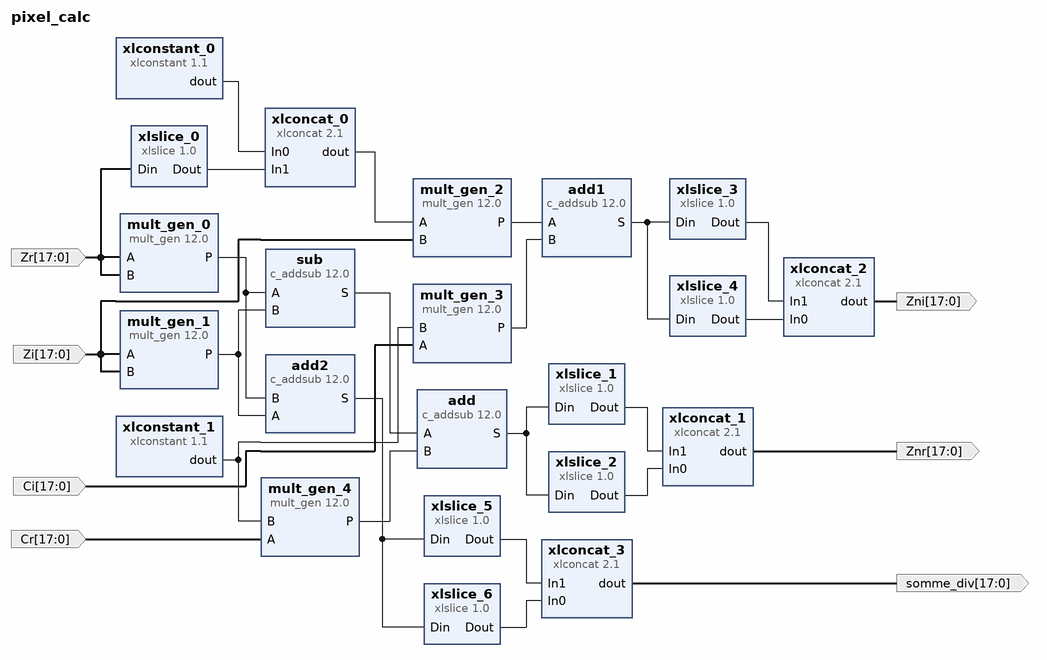
[diagram p0: block diagram of the top level]
# Vivado block design pixel_calc, xc7a200tsbg484-1, Vivado 2021.2
create_bd_design pixel_calc

create_bd_port -dir I -from 17 -to 0 -type data Ci
create_bd_port -dir I -from 17 -to 0 -type data Cr
create_bd_port -dir I -from 17 -to 0 -type data Zi
create_bd_port -dir O -from 17 -to 0 Zni
create_bd_port -dir O -from 17 -to 0 Znr
create_bd_port -dir I -from 17 -to 0 -type data Zr
create_bd_port -dir O -from 17 -to 0 somme_div

create_bd_cell -type ip -vlnv xilinx.com:ip:c_addsub:12.0 add
set_property -dict [list \
  CONFIG.A_Width 36 \
  CONFIG.Add_Mode Add \
  CONFIG.B_Value 000000000000000000000000000000000000 \
  CONFIG.B_Width 36 \
  CONFIG.CE false \
  CONFIG.Latency 0 \
  CONFIG.Out_Width 36 \
] [get_bd_cells add]
create_bd_cell -type ip -vlnv xilinx.com:ip:c_addsub:12.0 add1
set_property -dict [list \
  CONFIG.A_Width 36 \
  CONFIG.Add_Mode Add \
  CONFIG.B_Value 000000000000000000000000000000000000 \
  CONFIG.B_Width 36 \
  CONFIG.CE false \
  CONFIG.Latency 0 \
  CONFIG.Out_Width 36 \
] [get_bd_cells add1]
create_bd_cell -type ip -vlnv xilinx.com:ip:c_addsub:12.0 add2
set_property -dict [list \
  CONFIG.A_Width 36 \
  CONFIG.Add_Mode Add \
  CONFIG.B_Value 000000000000000000000000000000000000 \
  CONFIG.B_Width 36 \
  CONFIG.CE false \
  CONFIG.Latency 0 \
  CONFIG.Out_Width 36 \
] [get_bd_cells add2]
create_bd_cell -type ip -vlnv xilinx.com:ip:mult_gen:12.0 mult_gen_0
set_property -dict {CONFIG.Multiplier_Construction Use_Mults CONFIG.PipeStages 0} [get_bd_cells mult_gen_0]
create_bd_cell -type ip -vlnv xilinx.com:ip:mult_gen:12.0 mult_gen_1
set_property -dict {CONFIG.Multiplier_Construction Use_Mults CONFIG.PipeStages 0} [get_bd_cells mult_gen_1]
create_bd_cell -type ip -vlnv xilinx.com:ip:mult_gen:12.0 mult_gen_2
set_property -dict {CONFIG.Multiplier_Construction Use_Mults CONFIG.PipeStages 0} [get_bd_cells mult_gen_2]
create_bd_cell -type ip -vlnv xilinx.com:ip:mult_gen:12.0 mult_gen_3
set_property -dict {CONFIG.PipeStages 0} [get_bd_cells mult_gen_3]
create_bd_cell -type ip -vlnv xilinx.com:ip:mult_gen:12.0 mult_gen_4
set_property -dict {CONFIG.PipeStages 0} [get_bd_cells mult_gen_4]
create_bd_cell -type ip -vlnv xilinx.com:ip:c_addsub:12.0 sub
set_property -dict [list \
  CONFIG.A_Width 36 \
  CONFIG.Add_Mode Subtract \
  CONFIG.B_Value 000000000000000000000000000000000000 \
  CONFIG.B_Width 36 \
  CONFIG.CE false \
  CONFIG.Latency 0 \
  CONFIG.Out_Width 36 \
] [get_bd_cells sub]
create_bd_cell -type ip -vlnv xilinx.com:ip:xlconcat:2.1 xlconcat_0
set_property -dict {CONFIG.IN1_WIDTH 17} [get_bd_cells xlconcat_0]
create_bd_cell -type ip -vlnv xilinx.com:ip:xlconcat:2.1 xlconcat_1
set_property -dict {CONFIG.IN0_WIDTH 14 CONFIG.IN1_WIDTH 4} [get_bd_cells xlconcat_1]
create_bd_cell -type ip -vlnv xilinx.com:ip:xlconcat:2.1 xlconcat_2
set_property -dict {CONFIG.IN0_WIDTH 14 CONFIG.IN1_WIDTH 4} [get_bd_cells xlconcat_2]
create_bd_cell -type ip -vlnv xilinx.com:ip:xlconstant:1.1 xlconstant_0
set_property -dict {CONFIG.CONST_VAL 0 CONFIG.CONST_WIDTH 1} [get_bd_cells xlconstant_0]
create_bd_cell -type ip -vlnv xilinx.com:ip:xlconstant:1.1 xlconstant_1
set_property -dict {CONFIG.CONST_VAL 16384 CONFIG.CONST_WIDTH 18} [get_bd_cells xlconstant_1]
create_bd_cell -type ip -vlnv xilinx.com:ip:xlslice:1.0 xlslice_0
set_property -dict {CONFIG.DIN_FROM 16 CONFIG.DIN_TO 0 CONFIG.DIN_WIDTH 18 CONFIG.DOUT_WIDTH 17} [get_bd_cells xlslice_0]
create_bd_cell -type ip -vlnv xilinx.com:ip:xlslice:1.0 xlslice_1
set_property -dict {CONFIG.DIN_FROM 31 CONFIG.DIN_TO 28 CONFIG.DIN_WIDTH 36 CONFIG.DOUT_WIDTH 4} [get_bd_cells xlslice_1]
create_bd_cell -type ip -vlnv xilinx.com:ip:xlslice:1.0 xlslice_2
set_property -dict {CONFIG.DIN_FROM 27 CONFIG.DIN_TO 14 CONFIG.DIN_WIDTH 36 CONFIG.DOUT_WIDTH 14} [get_bd_cells xlslice_2]
create_bd_cell -type ip -vlnv xilinx.com:ip:xlslice:1.0 xlslice_3
set_property -dict {CONFIG.DIN_FROM 31 CONFIG.DIN_TO 28 CONFIG.DIN_WIDTH 36 CONFIG.DOUT_WIDTH 4} [get_bd_cells xlslice_3]
create_bd_cell -type ip -vlnv xilinx.com:ip:xlslice:1.0 xlslice_4
set_property -dict {CONFIG.DIN_FROM 27 CONFIG.DIN_TO 14 CONFIG.DIN_WIDTH 36 CONFIG.DOUT_WIDTH 14} [get_bd_cells xlslice_4]
create_bd_cell -type ip -vlnv xilinx.com:ip:xlslice:1.0 xlslice_5
set_property -dict {CONFIG.DIN_FROM 31 CONFIG.DIN_TO 28 CONFIG.DIN_WIDTH 36 CONFIG.DOUT_WIDTH 4} [get_bd_cells xlslice_5]
create_bd_cell -type ip -vlnv xilinx.com:ip:xlslice:1.0 xlslice_6
set_property -dict {CONFIG.DIN_FROM 27 CONFIG.DIN_TO 14 CONFIG.DIN_WIDTH 36 CONFIG.DOUT_WIDTH 14} [get_bd_cells xlslice_6]
create_bd_cell -type ip -vlnv xilinx.com:ip:xlconcat:2.1 xlconcat_3
set_property -dict {CONFIG.IN0_WIDTH 14 CONFIG.IN1_WIDTH 4} [get_bd_cells xlconcat_3]

# ---- connections ----

connect_bd_net -net A_0_1 [get_bd_ports Zr] [get_bd_pins mult_gen_0/A] [get_bd_pins mult_gen_0/B] [get_bd_pins xlslice_0/Din]
connect_bd_net -net A_0_2 [get_bd_ports Ci] [get_bd_pins mult_gen_3/A]
connect_bd_net -net A_0_3 [get_bd_ports Cr] [get_bd_pins mult_gen_4/A]
connect_bd_net -net A_1_1 [get_bd_ports Zi] [get_bd_pins mult_gen_1/A] [get_bd_pins mult_gen_1/B] [get_bd_pins mult_gen_2/B]
connect_bd_net [get_bd_pins add1/S] [get_bd_pins xlslice_3/Din] [get_bd_pins xlslice_4/Din]
connect_bd_net [get_bd_pins add2/S] [get_bd_pins xlslice_5/Din] [get_bd_pins xlslice_6/Din]
connect_bd_net [get_bd_pins add/S] [get_bd_pins xlslice_1/Din] [get_bd_pins xlslice_2/Din]
connect_bd_net -net c_addsub_0_S [get_bd_pins sub/S] [get_bd_pins add/A]
connect_bd_net [get_bd_pins mult_gen_0/P] [get_bd_pins add2/B] [get_bd_pins sub/A]
connect_bd_net [get_bd_pins mult_gen_1/P] [get_bd_pins add2/A] [get_bd_pins sub/B]
connect_bd_net [get_bd_pins mult_gen_2/P] [get_bd_pins add1/A]
connect_bd_net [get_bd_pins mult_gen_3/P] [get_bd_pins add1/B]
connect_bd_net [get_bd_pins mult_gen_4/P] [get_bd_pins add/B]
connect_bd_net [get_bd_pins xlconcat_0/dout] [get_bd_pins mult_gen_2/A]
connect_bd_net [get_bd_pins xlconcat_1/dout] [get_bd_ports Znr]
connect_bd_net [get_bd_pins xlconcat_2/dout] [get_bd_ports Zni]
connect_bd_net [get_bd_pins xlconcat_3/dout] [get_bd_ports somme_div]
connect_bd_net [get_bd_pins xlconstant_0/dout] [get_bd_pins xlconcat_0/In0]
connect_bd_net [get_bd_pins xlconstant_1/dout] [get_bd_pins mult_gen_3/B] [get_bd_pins mult_gen_4/B]
connect_bd_net [get_bd_pins xlslice_0/Dout] [get_bd_pins xlconcat_0/In1]
connect_bd_net [get_bd_pins xlslice_1/Dout] [get_bd_pins xlconcat_1/In1]
connect_bd_net [get_bd_pins xlslice_2/Dout] [get_bd_pins xlconcat_1/In0]
connect_bd_net [get_bd_pins xlslice_3/Dout] [get_bd_pins xlconcat_2/In1]
connect_bd_net [get_bd_pins xlslice_4/Dout] [get_bd_pins xlconcat_2/In0]
connect_bd_net [get_bd_pins xlslice_5/Dout] [get_bd_pins xlconcat_3/In1]
connect_bd_net [get_bd_pins xlslice_6/Dout] [get_bd_pins xlconcat_3/In0]

validate_bd_design
save_bd_design
